# Altium schematic sheet Capacitive_touch.SchDoc
size 228 x 139 mm; SheetNumber: 4; SheetTotal: 8
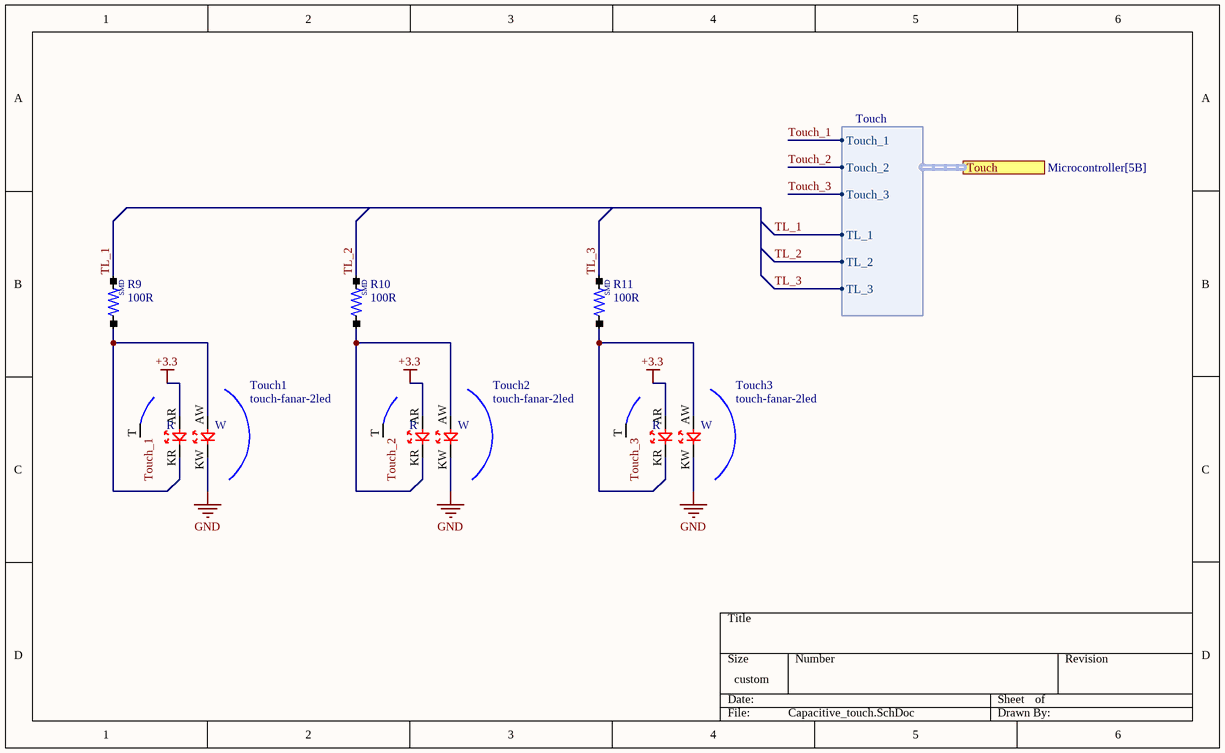
[diagram p0: Capacitive_touch.SchDoc]

## Parts
R9  100R  [RES/0603]
R10  100R  [RES/0603]
R11  100R  [RES/0603]
Touch1  touch-fanar-2led  [fanar-touch-2led]
Touch2  touch-fanar-2led  [fanar-touch-2led]
Touch3  touch-fanar-2led  [fanar-touch-2led]

## Ports
Touch (harness Touch, see Microcontroller[5B])

## Harnesses
Touch: Touch_1, Touch_2, Touch_3, TL_1, TL_2, TL_3

## Nets
+3.3: Touch1.AR Touch2.AR Touch3.AR
GND: Touch1.KW Touch2.KW Touch3.KW
TL_1: R9.2 ; port Touch.TL_1
TL_2: R10.2 ; port Touch.TL_2
TL_3: R11.2 ; port Touch.TL_3
Touch_1: Touch1.T ; port Touch.Touch_1
Touch_2: Touch2.T ; port Touch.Touch_2
Touch_3: Touch3.T ; port Touch.Touch_3
NetR9_1: R9.1 Touch1.AW Touch1.KR
NetR10_1: R10.1 Touch2.AW Touch2.KR
NetR11_1: R11.1 Touch3.AW Touch3.KR

## Notes on the sheet
- (in symbol RES/SMD) SMD
- (in symbol touch-fanar-2led) R; W

## Library data of the parts
R9-R11 = RES/SMD